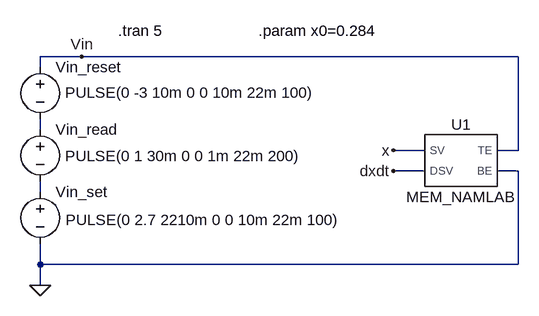
[diagram p0: schematic mem_pot_dep.asc]
mem_pot_dep.asc, the LTspice schematic file:
Version 4
SHEET 1 1352 680
WIRE -144 -160 -208 -160
WIRE 528 -160 -144 -160
WIRE -208 -144 -208 -160
WIRE -208 -48 -208 -64
WIRE 384 -16 336 -16
WIRE 528 -16 528 -160
WIRE 528 -16 496 -16
WIRE 384 16 336 16
WIRE 528 16 496 16
WIRE -208 48 -208 32
WIRE -208 160 -208 128
WIRE 528 160 528 16
WIRE 528 160 -208 160
WIRE -208 192 -208 160
FLAG -208 192 0
FLAG 336 -16 x
FLAG 336 16 dxdt
FLAG -144 -160 Vin
SYMBOL voltage -208 -160 R0
WINDOW 123 0 0 Left 0
WINDOW 39 0 0 Left 0
WINDOW 3 38 55 Left 2
SYMATTR Value PULSE(0 -3 10m 0 0 10m 22m 100)
SYMATTR InstName Vin_reset
SYMBOL Mem 432 0 R0
SYMATTR InstName U1
SYMBOL voltage -208 -64 R0
WINDOW 3 38 57 Left 2
WINDOW 123 0 0 Left 0
WINDOW 39 0 0 Left 0
SYMATTR Value PULSE(0 1 30m 0 0 1m 22m 200)
SYMATTR InstName Vin_read
SYMBOL voltage -208 32 R0
WINDOW 3 39 59 Left 2
WINDOW 123 0 0 Left 0
WINDOW 39 0 0 Left 0
SYMATTR Value PULSE(0 2.7 2210m 0 0 10m 22m 100)
SYMATTR InstName Vin_set
TEXT -88 -200 Left 2 !.tran 5
TEXT 128 -200 Left 2 !.param x0=0.284

The netlist it stands for:
* mem_pot_dep.asc
Vin_reset Vin N001 PULSE(0 -3 10m 0 0 10m 22m 100)
XU1 Vin 0 x dxdt MEM_NAMLAB  ; pins TE BE SV DSV
Vin_read N001 N002 PULSE(0 1 30m 0 0 1m 22m 200)
Vin_set N002 0 PULSE(0 2.7 2210m 0 0 10m 22m 100)
.tran 5
.param x0=0.284
.lib C:\Users\NAGARAJ V REDDY\Documents\NES\1SEM\NNMHA\Neuro-transistor-Simulation-with-Memristor-based-Memcapacitor-using-LTSPICE\src\base\MEM_NAMLAB.cir
.backanno
.end